# EasyEDA schematic Py car_2021-02-27.json
TITLE: Sheet_1; REV: 1.0; Date: 2021-02-25; Sheet: 1/1; Drawn By: Bogdan123123; Company: Your Company
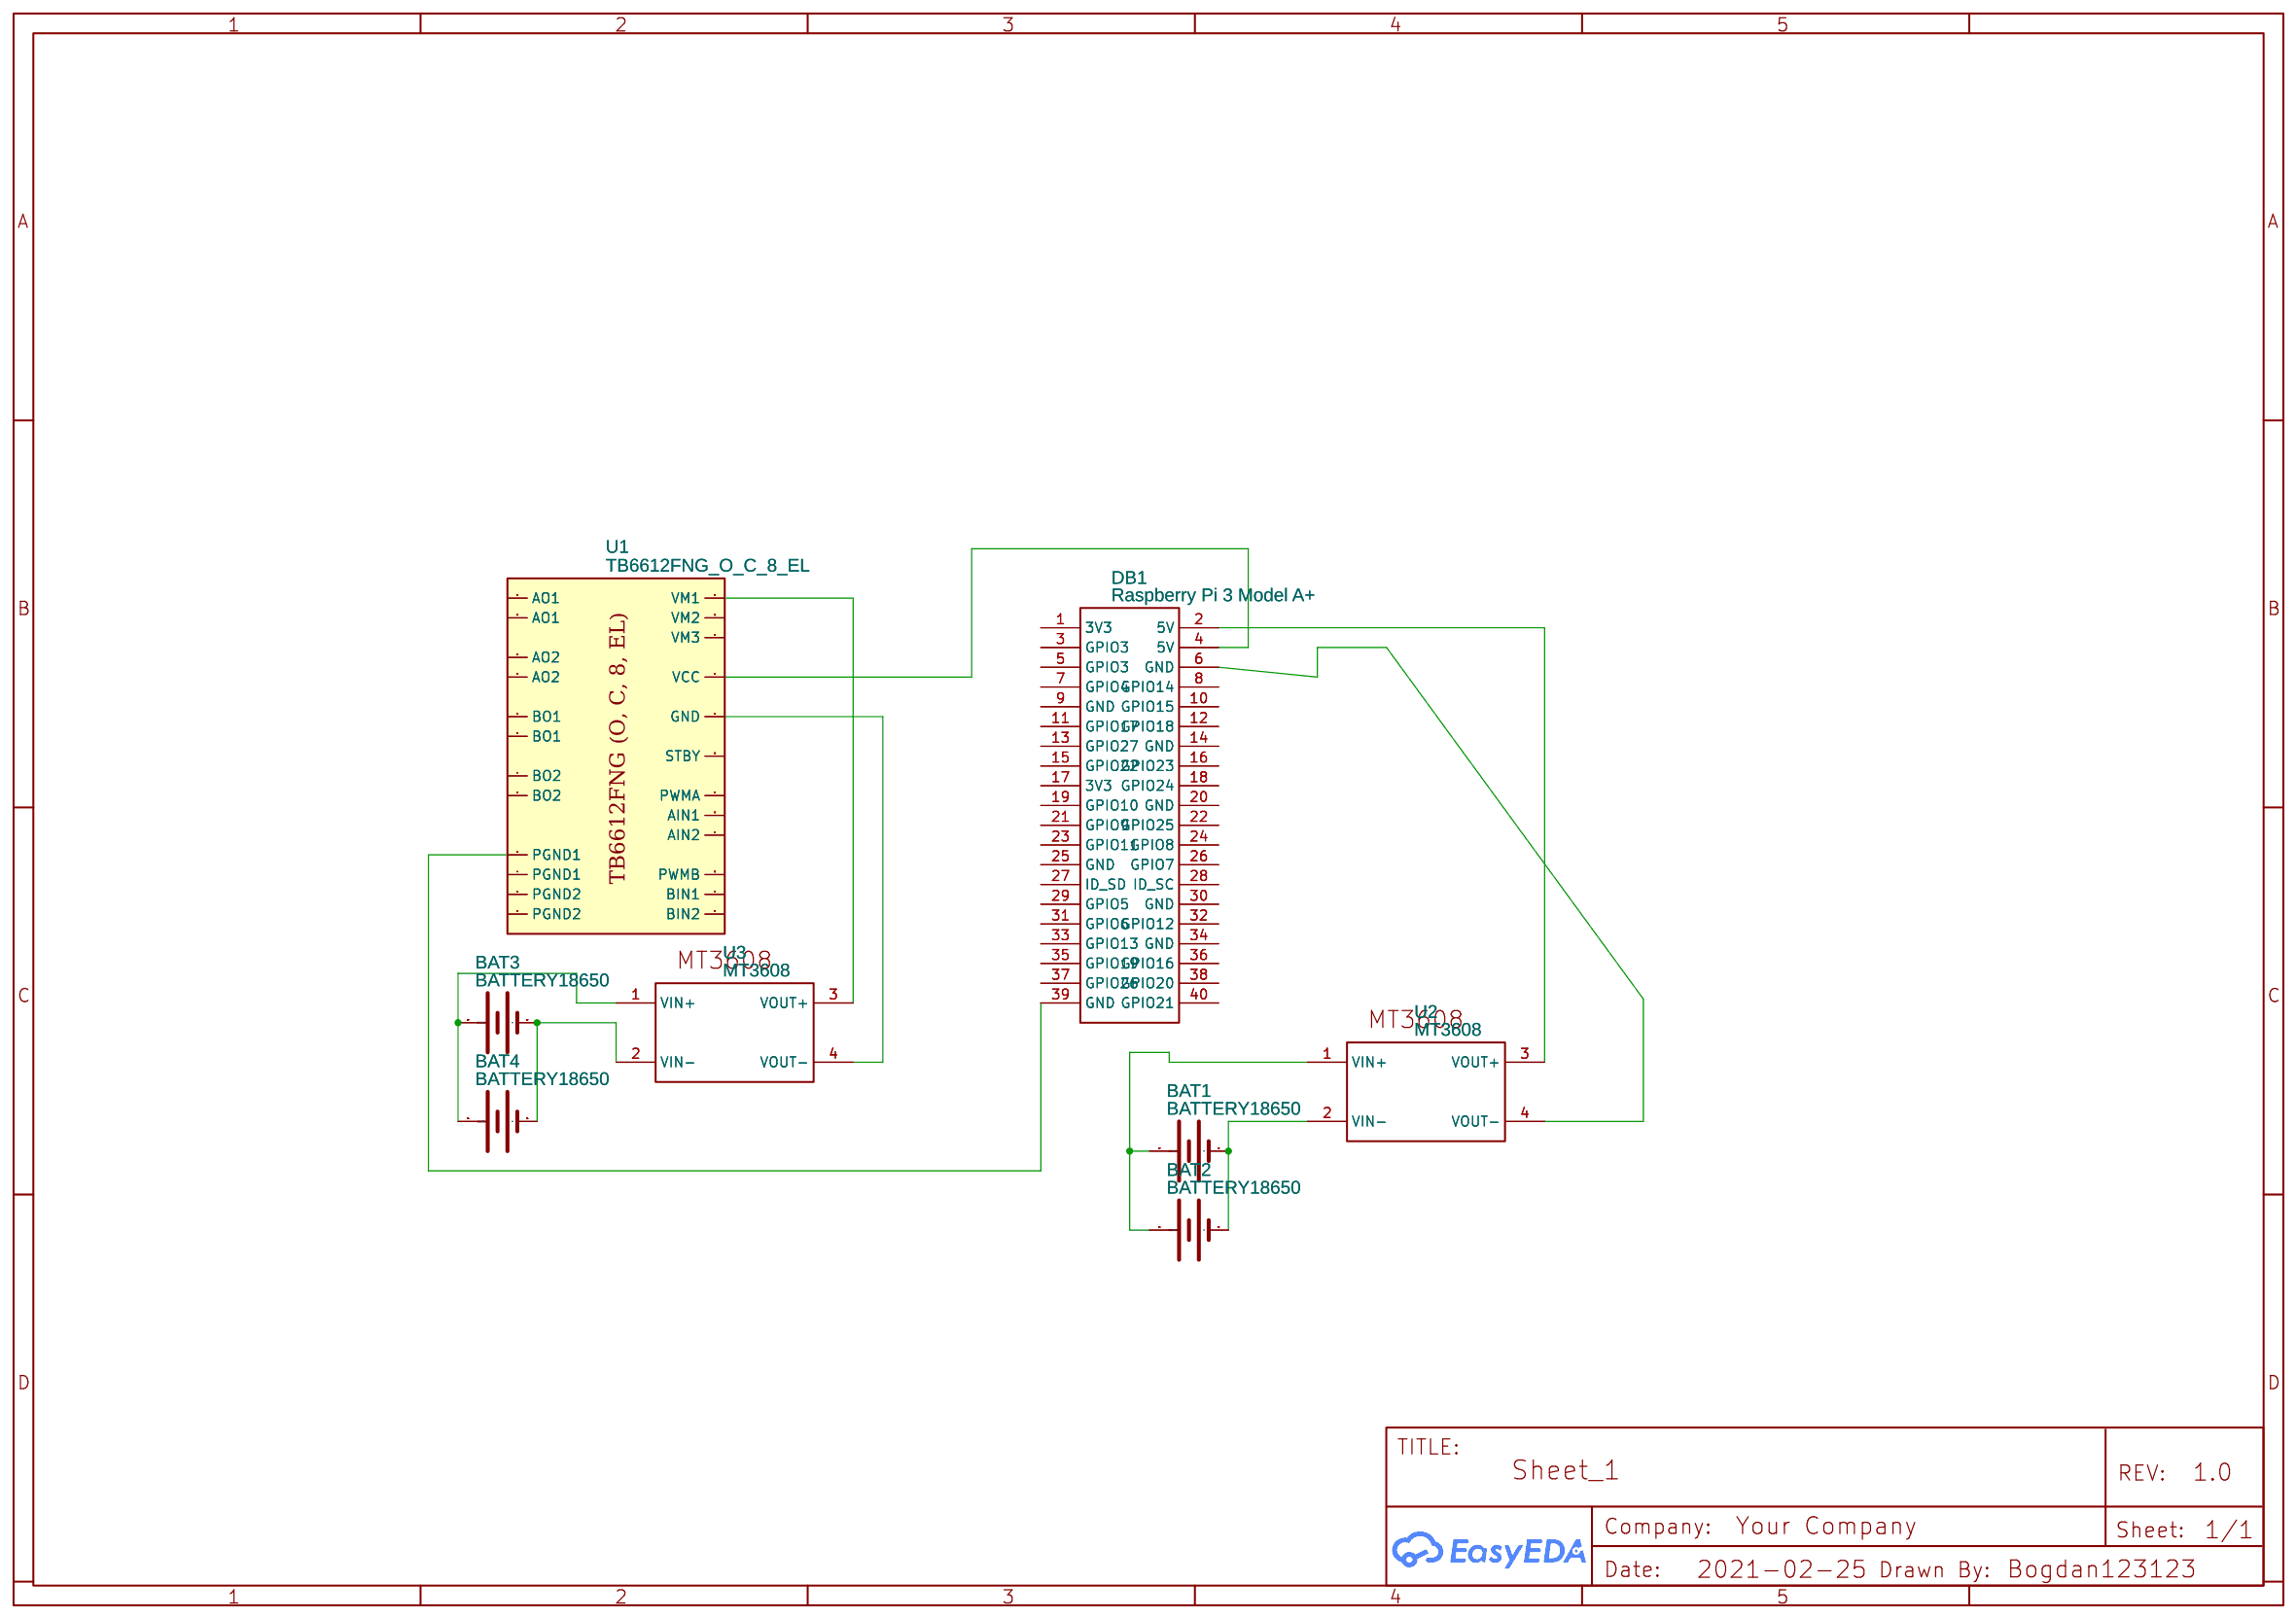
[diagram p0: schematic sheet]

## Parts
BAT1  BATTERY18650  [BATTERY_18650-HOLDER]
BAT2  BATTERY18650  [BATTERY_18650-HOLDER]
BAT3  BATTERY18650  [BATTERY_18650-HOLDER]
BAT4  BATTERY18650  [BATTERY_18650-HOLDER]
DB1  Raspberry Pi 3 Model A+
U1  TB6612FNG_O_C_8_EL  [TB6612FNG(O,C,8,EL)]
U2  MT3608  [MT3608_M]
U3  MT3608  [MT3608_M]

## Library data of the parts
BAT1-BAT4 = BATTERY18650: Battery Holders; Contributor: SparkFun
DB1 = Raspberry Pi 3 Model A+: Manufacturer: RASPBERRY-PI; Manufacturer Part: RPI3-MODAP; Supplier: Farnell; Supplier Part: 2946269; link: http://www.farnell.com/datasheets/2702628.pdf?_ga=2.235088961.1345213724.1544222275-235847458.1538770094; Contributor: gillfish101
U1 = TB6612FNG_O_C_8_EL: catid: 20; Contributor: Matty87; sim: true
U2 U3 = MT3608: Contributor: vadimch

## Nets
Net-(BAT1-GND@1): BAT1.GND@1(-) BAT2.GND@1(-) U2.2(VIN-)
Net-(BAT1-PWR@1): BAT1.PWR@1(+) BAT2.PWR@1(+) U2.1(VIN+)
Net-(BAT3-GND@1): BAT3.GND@1(-) BAT4.GND@1(-) U3.2(VIN-)
Net-(BAT3-PWR@1): BAT3.PWR@1(+) BAT4.PWR@1(+) U3.1(VIN+)
Net-(DB1-2): DB1.2(5V) U2.3(VOUT+)
Net-(DB1-4): DB1.4(5V) U1.20(VCC)
Net-(DB1-6): DB1.6(GND) U2.4(VOUT-)
Net-(DB1-39): DB1.39(GND) U1.3(PGND1)
Net-(U1-18): U1.18(GND) U3.4(VOUT-)
Net-(U1-24): U1.24(VM1) U3.3(VOUT+)

Not connected (* = marked no-connect by the designer): DB1 1(3V3) 3(GPIO3) 5(GPIO3) 7(GPIO4) 8(GPIO14) 9(GND) 10(GPIO15) 11(GPIO17) 12(GPIO18) 13(GPIO27) 14(GND) 15(GPIO22) 16(GPIO23) 17(3V3) 18(GPIO24) 19(GPIO10) 20(GND) 21(GPIO9) 22(GPIO25) 23(GPIO11) 24(GPIO8) 25(GND) 26(GPIO7) 27(ID_SD) 28(ID_SC) 29(GPIO5) 30(GND) 31(GPIO6) 32(GPIO12) 33(GPIO13) 34(GND) 35(GPIO19) 36(GPIO16) 37(GPIO26) 38(GPIO20) 40(GPIO21); U1 1(AO1) 2(AO1) 4(PGND1) 5(AO2) 6(AO2) 7(BO2) 8(BO2) 9(PGND2) 10(PGND2) 11(BO1) 12(BO1) 13(VM2) 14(VM3) 15(PWMB) 16(BIN2) 17(BIN1) 19(STBY) 21(AIN1) 22(AIN2) 23(PWMA)
